# Altium schematic sheet ScoreDisplay_2.SchDoc: Score Display 2
size A4
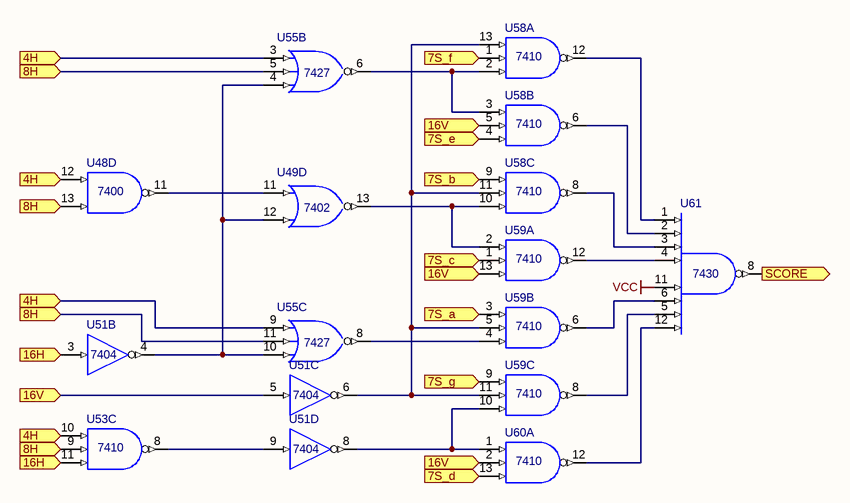
[diagram p0: ScoreDisplay_2.SchDoc]

## Parts
U48  7400  [N014]  (part D of 4)
U49  7402  [N014]  (part D of 4)
U51  7404  [N014]  (parts B,C,D of 6)
U53  7410  [N014]  (part C of 3)
U55  7427  [N014]  (parts B,C of 3)
U58  7410  [N014]  (parts A,B,C of 3)
U59  7410  [N014]  (parts A,B,C of 3)
U60  7410  [N014]  (part A of 3)
U61  7430  [N014]

## Ports
4H, 7S_a, 7S_b, 7S_c, 7S_d, 7S_e, 7S_f, 7S_g, 8H, 16H, 16V, SCORE

## Nets
GND: U48.7(GND) U49.7(GND) U51.7(GND) U53.7(GND) U55.7(GND) U58.7(GND) U59.7(GND) U60.7(GND) U61.7(GND)
VCC: U48.14(VCC) U49.14(VCC) U51.14(VCC) U53.14(VCC) U55.14(VCC) U58.14(VCC) U59.14(VCC) U60.14(VCC) U61.11(G) U61.14(VCC)
4H: U48.12(A) U53.10(B) U55.3(A) U55.9(A) ; port 4H
7S_a: U59.3(A) ; port 7S_a
7S_b: U58.9(A) ; port 7S_b
7S_c: U59.1(A) ; port 7S_c
7S_d: U60.13(C) ; port 7S_d
7S_e: U58.4(B) ; port 7S_e
7S_f: U58.1(A) ; port 7S_f
7S_g: U59.9(A) ; port 7S_g
8H: U48.13(B) U53.9(A) U55.5(C) U55.11(C) ; port 8H
16H: U51.3(A) U53.11(C) ; port 16H
16V: U51.5(A) U58.5(C) U59.13(C) U60.2(B) ; port 16V
SCORE: U61.8(Y) ; port SCORE
NetU48_11: U48.11(Y) U49.11(A)
NetU49_12: U49.12(B) U51.4(Y) U55.4(B) U55.10(B)
NetU49_13: U49.13(Y) U58.10(B) U59.2(B)
NetU51_6: U51.6(Y) U58.11(C) U58.13(C) U59.5(C) U59.11(C)
NetU51_8: U51.8(Y) U59.10(B) U60.1(A)
NetU51_9: U51.9(A) U53.8(Y)
NetU55_6: U55.6(Y) U58.2(B) U58.3(A)
NetU55_8: U55.8(Y) U59.4(B)
NetU58_6: U58.6(Y) U61.2(B)
NetU58_8: U58.8(Y) U61.3(C)
NetU58_12: U58.12(Y) U61.1(A)
NetU59_6: U59.6(Y) U61.6(F)
NetU59_8: U59.8(Y) U61.5(E)
NetU59_12: U59.12(Y) U61.4(D)
NetU60_12: U60.12(Y) U61.12(H)

## Notes on the sheet
- Text
- Page
- PONG

## Library data of the parts
U48 = SN74LS00N: Quadruple 2-Input Positive-NAND Gate; Published: 8-Jun-2000; LatestRevisionDate: 04-Mar-2005; LatestRevisionNote: Stylized 3D Model Added.; DatasheetVersion: Mar-1988; PackageVersion: Oct-1995; PackageReference: N014; Publisher: Altium Limited; PackageDescription: DIP; 14 Leads; Row Spacing 7.62 mm; Pitch 2.54 mm; ComponentLink1Description: Manufacturer Link; ComponentLink1URL: http://www.ti.com/; ComponentLink2Description: Datasheet; ComponentLink2URL: http://www-s.ti.com/sc/ds/sn74ls00.pdf
U49 = SN74LS02N: Quadruple 2-Input Positive-NOR Gate; Published: 8-Jun-2000; LatestRevisionDate: 04-Mar-2005; LatestRevisionNote: Stylized 3D Model Added.; DatasheetVersion: Mar-1988; PackageVersion: Oct-1995; PackageReference: N014; Publisher: Altium Limited; PackageDescription: DIP; 14 Leads; Row Spacing 7.62 mm; Pitch 2.54 mm; ComponentLink1Description: Manufacturer Link; ComponentLink1URL: http://www.ti.com/; ComponentLink2Description: Datasheet; ComponentLink2URL: http://www-s.ti.com/sc/ds/sn54s02.pdf
U51 = SN74LS04N: Hex Inverter; Published: 8-Jun-2000; LatestRevisionDate: 04-Mar-2005; LatestRevisionNote: Stylized 3D Model Added.; DatasheetVersion: Mar-1988; PackageVersion: Oct-1995; PackageReference: N014; Publisher: Altium Limited; PackageDescription: DIP; 14 Leads; Row Spacing 7.62 mm; Pitch 2.54 mm; ComponentLink1Description: Manufacturer Link; ComponentLink1URL: http://www.ti.com/; ComponentLink2Description: Datasheet; ComponentLink2URL: http://www-s.ti.com/sc/ds/sn74ls04.pdf
U53 U58-U60 = SN74LS10N: Triple 3-Input Positive-NAND Gate; Published: 8-Jun-2000; LatestRevisionDate: 04-Mar-2005; LatestRevisionNote: Stylized 3D Model Added.; DatasheetVersion: Mar-1988; PackageVersion: Oct-1995; PackageReference: N014; Publisher: Altium Limited; PackageDescription: DIP; 14 Leads; Row Spacing 7.62 mm; Pitch 2.54 mm; ComponentLink1Description: Manufacturer Link; ComponentLink1URL: http://www.ti.com/; ComponentLink2Description: Datasheet; ComponentLink2URL: http://www-s.ti.com/sc/ds/sn74ls10.pdf
U55 = SN74LS27N: Triple 3-Input Positive-NOR Gate; Published: 8-Jun-2000; LatestRevisionDate: 04-Mar-2005; LatestRevisionNote: Stylized 3D Model Added.; DatasheetVersion: Mar-1988; PackageVersion: Oct-1995; PackageReference: N014; Publisher: Altium Limited; PackageDescription: DIP; 14 Leads; Row Spacing 7.62 mm; Pitch 2.54 mm; ComponentLink1Description: Manufacturer Link; ComponentLink1URL: http://www.ti.com/; ComponentLink2Description: Datasheet; ComponentLink2URL: http://www-s.ti.com/sc/ds/sn74ls27.pdf
U61 = SN74LS30N: 8-Input Positive-NAND Gate; Note: Pins 9, 10  and 13 are NC & not drawn.; Published: 8-Jun-2000; LatestRevisionDate: 04-Mar-2005; LatestRevisionNote: Stylized 3D Model Added.; DatasheetVersion: Mar-1988; PackageVersion: Oct-1995; PackageReference: N014; Publisher: Altium Limited; PackageDescription: DIP; 14 Leads; Row Spacing 7.62 mm; Pitch 2.54 mm; ComponentLink1Description: Manufacturer Link; ComponentLink1URL: http://www.ti.com/; ComponentLink2Description: Datasheet; ComponentLink2URL: http://www-s.ti.com/sc/ds/sn74s30.pdf